# Altium project openmv-rt1062.PrjPcb
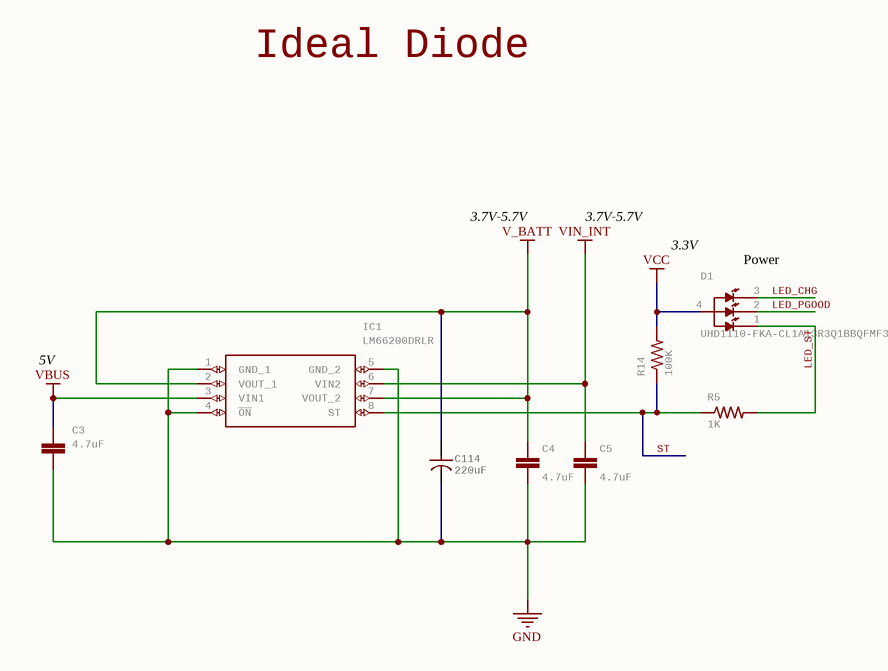
[diagram p0: ideal-diode.SchDoc]
8 sheets, 160 parts. Net scope: global (net labels, ports and power ports of the same name join across sheets).
Board file: rt10.PcbDoc
Sheets:
  ideal-diode.SchDoc
  battery-charging.SchDoc
  regulators.SchDoc
  sd-card.SchDoc
  sensor-header.SchDoc
  jtag.SchDoc
  wifi-bt.SchDoc
  mimxrt10xx.SchDoc

## Sheet ideal-diode.SchDoc
size A

### Parts
C3  4.7uF  [0402-CAP]
C4  4.7uF  [0402-CAP]
C5  4.7uF  [0402-CAP]
C114  220uF  [CAP-TANT-1411]
D1  UHD1110-FKA-CL1A13R3Q1BBQFMF3  [LED_UHD1110-FKA-CL1A13R3Q1BBQFMF3]
IC1  LM66200DRLR  [SOTFL50P160X60-8N]
R5  1K  [0402-RES]
R14  100K  [0402-RES]

### Nets
GND: C3.1 C4.1 C5.1 C114.2 IC1.1(GND_1) IC1.4(~{ON}) IC1.5(GND_2)
V_BATT: C4.2 C114.1 IC1.2(VOUT_1) IC1.7(VOUT_2)
VBUS: C3.2 IC1.3(VIN1)
VCC: D1.4(ANODE) R14.2
VIN_INT: C5.2 IC1.6(VIN2)
LED_CHG: D1.3(RED)
LED_PGOOD: D1.2(GREEN)
LED_ST: D1.1(BLUE) R5.2
ST: IC1.8(ST) R5.1 R14.1

### Notes on the sheet
- Ideal Diode
- 3.7V-5.7V
- (near D1) 3.3V
- (near D1) Power
- 5V

### Library data of the parts
C3-C5 = CAP0402-CAP: CapacitorStandard 0603 ceramic capacitor, and 0.1" leaded capacitor.; MPN: JMK105BBJ475MV-F; GateName_1: G$1; SymbolName_1: CAP; DeviceName: 0402-CAP; LibraryName: sfe; DeviceSetName: CAP; Part Number: JMK105BBJ475MV-F
C114 = CAP_POL: MANUFACTURER P/N: F930J227MBA; Part Number: F930J227MBA; DISTRIBUTOR: *; DISTRIBUTOR P/N: *; Value: 220uF; Parameter 1: *; MPN: F930J227MBA
D1 = UHD1110-FKA-CL1A13R3Q1BBQFMF3: LED RGB SMD, SIZE 1 X 1 mm Check availability; GateName_1: G$1; MF: Cree Inc.; SymbolName_1: UHD1110-FKA-CL1A13R3Q1BBQFMF3; LibraryName: UHD1110-FKA-CL1A13R3Q1BBQFMF3; DeviceSetName: UHD1110-FKA-CL1A13R3Q1BBQFMF3; AVAILABILITY: In Stock; MP: UHD1110-FKA-CL1A13R3Q1BBQFMF3; MPN: UHD1110-FKA-CL1A13r3q1BBQFMF3; PACKAGE: 0404 Cree Inc.; PRICE: None; PURCHASE-URL: https://pricing.snapeda.com/search/part/UHD1110-FKA-CL1A13R3Q1BBQFMF3/?ref=eda; Part Number: UHD1110-FKA-CL1A13r3q1BBQFMF3
IC1 = LM66200DRLR: 1.6-V to 5.5-V, 40-m, 2.5-A, low-IQ, dual ideal diode   Source:  Datasheet; MANUFACTURER_NAME: Texas Instruments; GateName_1: G$1; SymbolName_1: LM66200DRLR; LibraryName: LM66200DRLR; DeviceSetName: LM66200DRLR; HEIGHT: 0.6mm; MANUFACTURER_PART_NUMBER: LM66200DRLR; MOUSER_PART_NUMBER: 595-LM66200DRLR; MOUSER_PRICE-STOCK: https://www.mouser.co.uk/ProductDetail/Texas-Instruments/LM66200DRLR?qs=Rp5uXu7WBW90hnpZAkIOdQ%3D%3D; MPN: LM66200DRLR; Part Number: LM66200DRLR
R5 = RESISTOR0402-RES: ResistorBasic schematic elements and footprints for 0603, 1206, and PTH resistors.; MPN: CRCW04021K00FKEDC; GateName_1: G$1; SymbolName_1: RESISTOR; DeviceName: 0402-RES; LibraryName: sfe; DeviceSetName: RESISTOR; Part Number: CRCW04021K00FKEDC
R14 = RESISTOR0402-RES: ResistorBasic schematic elements and footprints for 0603, 1206, and PTH resistors.; MPN: AC0402FR-07100KL; GateName_1: G$1; SymbolName_1: RESISTOR; DeviceName: 0402-RES; LibraryName: sfe; DeviceSetName: RESISTOR; Part Number: AC0402FR-07100KL

## Sheet battery-charging.SchDoc
size A
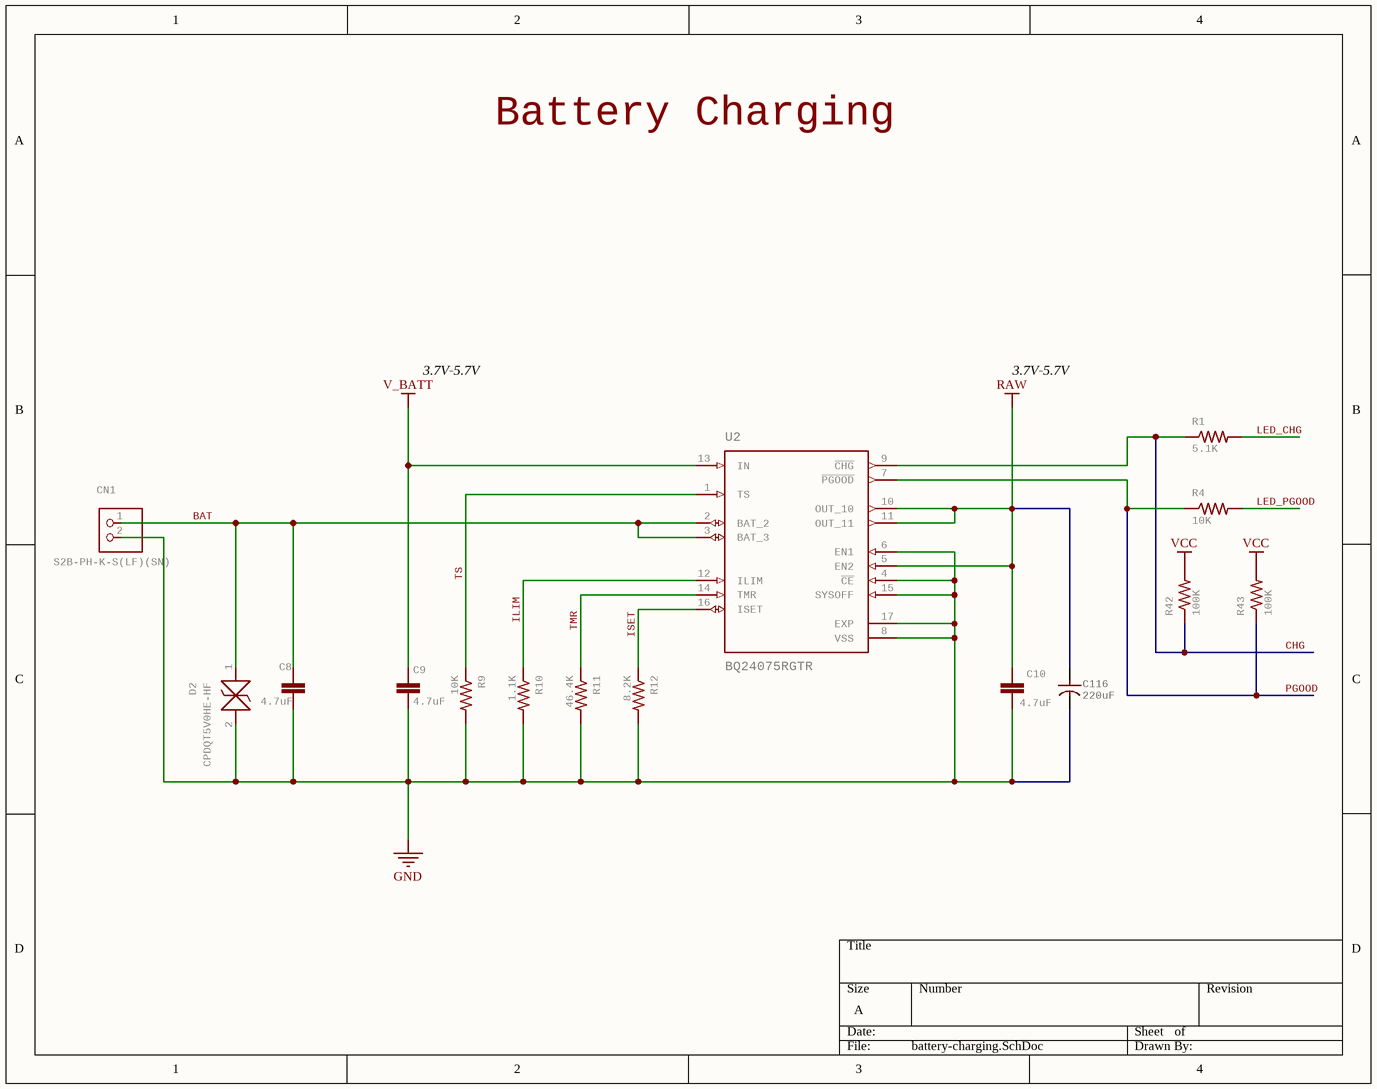
[diagram p1: battery-charging.SchDoc]

### Parts
C8  4.7uF  [0402-CAP]
C9  4.7uF  [0402-CAP]
C10  4.7uF  [0402-CAP]
C116  220uF  [CAP-TANT-1411]
CN1  S2B-PH-K-S(LF)(SN)  [JST-PH-2-THM-RA]
D2  CPDQT5V0HE-HF  [CPDQT5V0HEHF]
R1  5.1K  [0402-RES]
R4  10K  [0402-RES]
R9  10K  [0402-RES]
R10  1.1K  [0402-RES]
R11  46.4K  [0402-RES]
R12  8.2K  [0402-RES]
R42  100K  [0402-RES]
R43  100K  [0402-RES]
U2  BQ24075RGTR  [QFN50P300X300X100-17N]

### Nets
GND: C8.1 C9.1 C10.1 C116.2 CN1.2 D2.2 R9.2 R10.2 R11.2 R12.2 U2.4(~{CE}) U2.6(EN1) U2.8(VSS) U2.15(SYSOFF) U2.17(EXP)
RAW: C10.2 C116.1 U2.5(EN2) U2.10(OUT_10) U2.11(OUT_11)
V_BATT: C9.2 U2.13(IN)
VCC: R42.2 R43.2
BAT: C8.2 CN1.1 D2.1 U2.2(BAT_2) U2.3(BAT_3)
CHG: R1.1 R42.1 U2.9(~{CHG})
ILIM: R10.1 U2.12(ILIM)
ISET: R12.1 U2.16(ISET)
LED_CHG: R1.2
LED_PGOOD: R4.2
PGOOD: R4.1 R43.1 U2.7(~{PGOOD})
TMR: R11.1 U2.14(TMR)
TS: R9.1 U2.1(TS)

### Notes on the sheet
- Battery Charging
- 3.7V-5.7V

### Library data of the parts
C8-C10 = CAP0402-CAP: as C3 on sheet ideal-diode; DeviceName: 0402-CAP; LibraryName: sfe; DeviceSetName: CAP; Part Number: JMK105BBJ475MV-F
C116 = CAP_POL: MANUFACTURER P/N: F930J227MBA; Part Number: F930J227MBA; DISTRIBUTOR: *; DISTRIBUTOR P/N: *; Value: 220uF; Parameter 1: *; MPN: F930J227MBA
CN1 = JST_2PIN-THM-RA: JST 2-Pin Connectors of various flavors SMT-RA (S2B-PH-SM4) 4UConnector #17311  SMT  (B2B-PH-SM4)  THM-RA (S2B-PH)  THM  (B2B-PH); GateName_1: G$1; SymbolName_1: PINHD2; DeviceName: -THM-RA; LibraryName: adafruit-updated; DeviceSetName: JST_2PIN; MPN: S2B-PH-K-S(LF)(SN); Part Number: S2B-PH-K-S(LF)(SN)
D2 = CPDQT5V0HE-HF: ESD Suppressors / TVS Diodes DIODE ESD 5VWM 65W 0402/SOD-923F   Source:  Datasheet; MANUFACTURER_NAME: Comchip Technology; GateName_1: G$1; SymbolName_1: CPDQT5V0HE-HF; LibraryName: CPDQT5V0HE-HF; DeviceSetName: CPDQT5V0HE-HF; HEIGHT: 0.42mm; MANUFACTURER_PART_NUMBER: CPDQT5V0HE-HF; MOUSER_PART_NUMBER: MOUSER_PART_NUMBER; MOUSER_PRICE-STOCK: MOUSER_PRICE-STOCK; MPN: CPDQT5V0HE-HF; Part Number: CPDQT5V0HE-HF
R1 = RESISTOR0402-RES: ResistorBasic schematic elements and footprints for 0603, 1206, and PTH resistors.; MPN: RC0402JR-075K1L; GateName_1: G$1; SymbolName_1: RESISTOR; DeviceName: 0402-RES; LibraryName: sfe; DeviceSetName: RESISTOR; Part Number: RC0402JR-075K1L
R4 R9 = RESISTOR0402-RES: ResistorBasic schematic elements and footprints for 0603, 1206, and PTH resistors.; MPN: AC0402FR-1310KL; GateName_1: G$1; SymbolName_1: RESISTOR; DeviceName: 0402-RES; LibraryName: sfe; DeviceSetName: RESISTOR; Part Number: AC0402FR-1310KL
R10 = RESISTOR0402-RES: ResistorBasic schematic elements and footprints for 0603, 1206, and PTH resistors.; MPN: RC0402JR-071K1; GateName_1: G$1; SymbolName_1: RESISTOR; DeviceName: 0402-RES; LibraryName: sfe; DeviceSetName: RESISTOR; Part Number: RC0402JR-071K1
R11 = RESISTOR0402-RES: ResistorBasic schematic elements and footprints for 0603, 1206, and PTH resistors.; MPN: WR04X4642FTL; GateName_1: G$1; SymbolName_1: RESISTOR; DeviceName: 0402-RES; LibraryName: sfe; DeviceSetName: RESISTOR; Part Number: WR04X4642FTL
R12 = RESISTOR0402-RES: ResistorBasic schematic elements and footprints for 0603, 1206, and PTH resistors.; MPN: CR0402-FX-8201GLF; GateName_1: G$1; SymbolName_1: RESISTOR; DeviceName: 0402-RES; LibraryName: sfe; DeviceSetName: RESISTOR; Part Number: CR0402-FX-8201GLF
R42 R43 = RESISTOR0402-RES: as R14 on sheet ideal-diode; SymbolName_1: RESISTOR; DeviceName: 0402-RES; LibraryName: sfe; DeviceSetName: RESISTOR; Part Number: AC0402FR-07100KL
U2 = BQ24075RGTR: Standalone 1-cell 1.5-A linear charger, Power Path, 4.2-V VBAT and 5.5-V VOUT 16-VQFN -40 to 85  Check availability; GateName_1: G$1; MF: Texas Instruments; SymbolName_1: BQ24075RGTR; LibraryName: BQ24075RGTR; DeviceSetName: BQ24075RGTR; AVAILABILITY: In Stock; MP: BQ24075RGTR; MPN: BQ24075RGTR; PACKAGE: VQFN-16 Texas Instruments; PRICE: None; PURCHASE-URL: https://pricing.snapeda.com/search/part/BQ24075RGTR/?ref=eda; Part Number: BQ24075RGTR

## Sheet regulators.SchDoc
size A
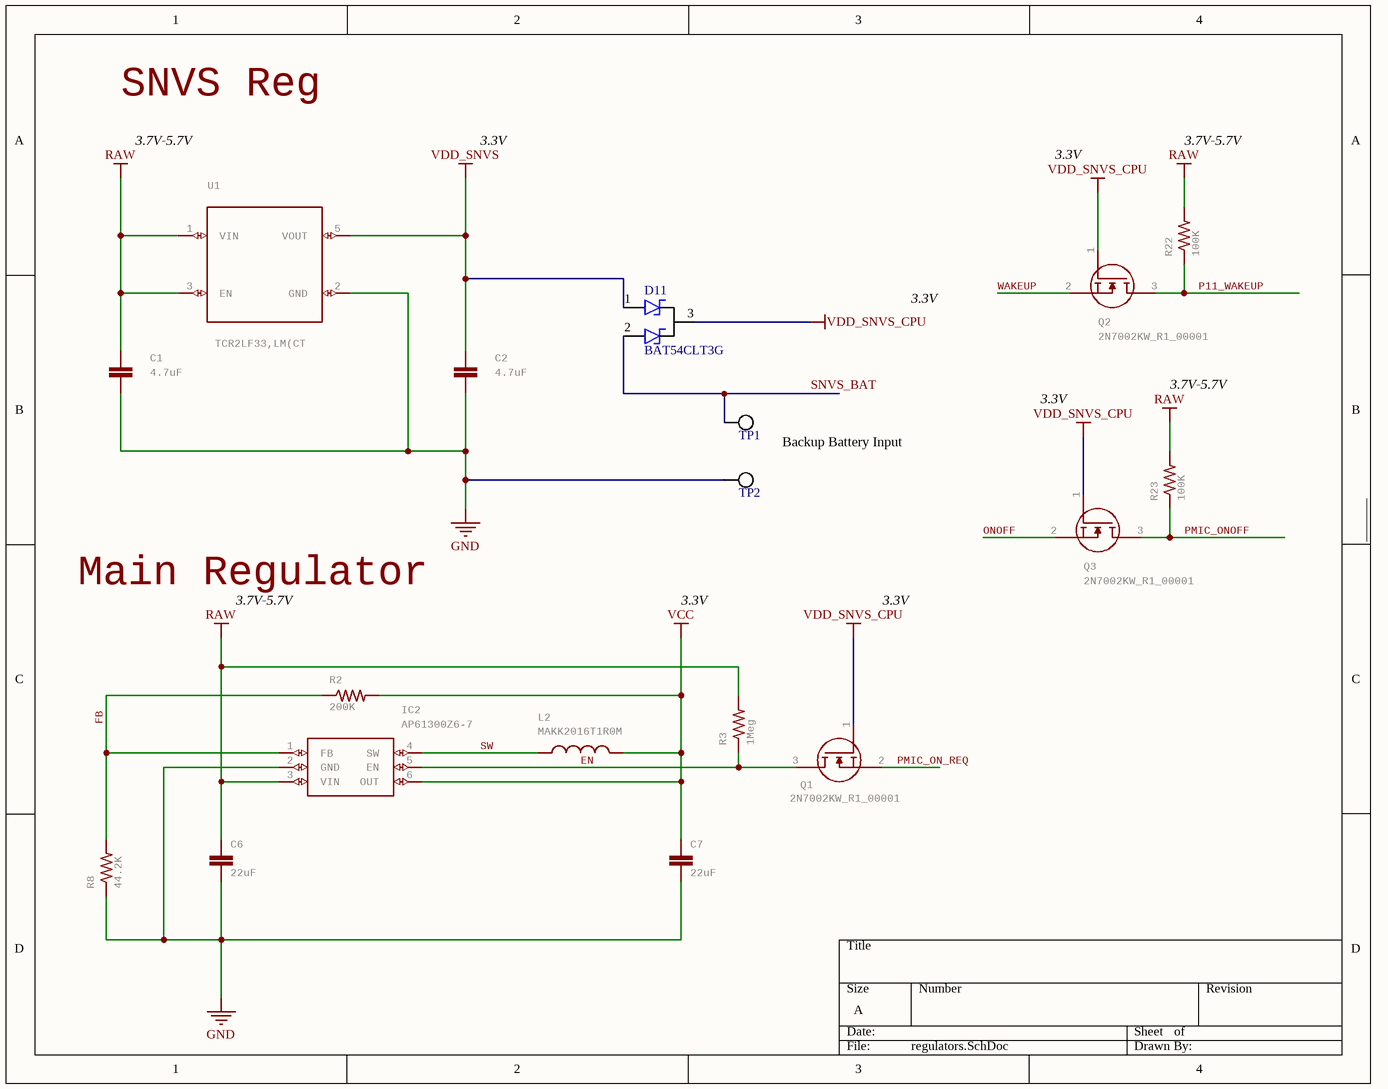
[diagram p2: regulators.SchDoc]

### Parts
C1  4.7uF  [0402-CAP]
C2  4.7uF  [0402-CAP]
C6  22uF  [0805]
C7  22uF  [0805]
D11  MPN: BAT54CLT3G  [SOT-23-3]  (hidden comment: Dual Schottky)
IC2  AP61300Z6-7  [SOTFL50P162X60-6N]
L2  MAKK2016T1R0M  [INDC2016X100N]
Q1  2N7002KW_R1_00001  [SOT65P210X110-3N]
Q2  2N7002KW_R1_00001  [SOT65P210X110-3N]
Q3  2N7002KW_R1_00001  [SOT65P210X110-3N]
R2  200K  [0402-RES]
R3  1Meg  [0402-RES]
R8  44.2K  [0402-RES]
R22  100K  [0402-RES]
R23  100K  [0402-RES]
TP1  TP  [TP_1p8]  (value not drawn)  (no BOM)
TP2  TP  [TP_1p8]  (value not drawn)  (no BOM)
U1  TCR2LF33,LM(CT  [SOT-23-5]

### Nets
GND: C1.1 C2.1 C6.2 C7.2 IC2.2(GND) R8.1 TP2.1 U1.2(GND)
RAW: C1.2 C6.1 IC2.3(VIN) R3.2 R22.2 R23.2 U1.1(VIN) U1.3(EN)
VCC: C7.1 IC2.6(OUT) L2.2 R2.2
VDD_SNVS: C2.2 D11.1 U1.5(VOUT)
VDD_SNVS_CPU: D11.3 Q1.1(G) Q2.1(G) Q3.1(G)
EN: IC2.5(EN) Q1.3(D) R3.1
FB: IC2.1(FB) R2.1 R8.2
ONOFF: Q3.2(S)
P11_WAKEUP: Q2.3(D) R22.1
PMIC_ON_REQ: Q1.2(S)
PMIC_ONOFF: Q3.3(D) R23.1
SNVS_BAT: D11.2 TP1.1
SW: IC2.4(SW) L2.1
WAKEUP: Q2.2(S)

### Notes on the sheet
- SNVS Reg
- 3.7V-5.7V
- 3.3V
- Backup Battery Input
- Main Regulator

### Library data of the parts
C1 C2 = CAP0402-CAP: as C3 on sheet ideal-diode; DeviceName: 0402-CAP; LibraryName: sfe; DeviceSetName: CAP; Part Number: JMK105BBJ475MV-F
C6 C7 = 22UF-0805-6.3V-20%: 22ÂµF ceramic capacitors    A capacitor is a passive two-terminal electrical component used to store electrical energy temporarily in an electric field.; MPN: CL21A226MQQNNNE; GateName_1: G$1; SymbolName_1: CAP; PROD_ID: CAP-08402; DeviceName: -0805-6.3V-20%; LibraryName: SparkFun-Capacitors; DeviceSetName: 22UF; Part Number: CL21A226MQQNNNE
D11 = Dual Schottky: Value: ?V; Part Number: BAT54CLT3G
IC2 = AP61300Z6-7: DCDC Conv LV Buck SOT563 T&R 3K   Source:  Datasheet; MANUFACTURER_NAME: Diodes Inc.; GateName_1: G$1; SymbolName_1: AP61300Z6-7; LibraryName: AP61300Z6-7; DeviceSetName: AP61300Z6-7; HEIGHT: 0.6mm; MANUFACTURER_PART_NUMBER: AP61300Z6-7; MOUSER_PART_NUMBER: 621-AP61300Z6-7; MOUSER_PRICE-STOCK: https://www.mouser.co.uk/ProductDetail/Diodes-Incorporated/AP61300Z6-7?qs=HBWAp0VN4Ri0dzb0XP2pEA%3D%3D; MPN: AP61300Z6-7; Part Number: AP61300Z6-7
L2 = MAKK2016T1R0M: Ind Power Wirewound 1uH 20% 2MHz Metal 2200mA 0806 Check availability; GateName_1: G$1; MF: Taiyo Yuden; SymbolName_1: MAKK2016T1R0M; LibraryName: MAKK2016T1R0M; DeviceSetName: MAKK2016T1R0M; AVAILABILITY: In Stock; MP: MAKK2016T1R0M; MPN: MAKK2016T1R0M; PACKAGE: 2016 Taiyo Yuden; PRICE: None; PURCHASE-URL: https://pricing.snapeda.com/search/part/MAKK2016T1R0M/?ref=eda; Part Number: MAKK2016T1R0M
Q1-Q3 = 2N7002KW_R1_00001: MOSFET 60V N-Channel Enhancement Mode MOSFET - ESD Protected   Source:  Datasheet; MANUFACTURER_NAME: PANJIT; GateName_1: G$1; SymbolName_1: 2N7002KW_R1_00001; LibraryName: 2N7002KW_R1_00001; DeviceSetName: 2N7002KW_R1_00001; HEIGHT: 1.1mm; MANUFACTURER_PART_NUMBER: 2N7002KW_R1_00001; MOUSER_PART_NUMBER: 241-2N7002KWR100001; MOUSER_PRICE-STOCK: https://www.mouser.co.uk/ProductDetail/Panjit/2N7002KW_R1_00001?qs=sPbYRqrBIVliWKATqv7jNA%3D%3D; MPN: 2N7002KW_R1_00001; Part Number: 2N7002KW_R1_00001
R2 = RESISTOR0402-RES: ResistorBasic schematic elements and footprints for 0603, 1206, and PTH resistors.; MPN: CRCW0402200KFKEDC; GateName_1: G$1; SymbolName_1: RESISTOR; DeviceName: 0402-RES; LibraryName: sfe; DeviceSetName: RESISTOR; Part Number: CRCW0402200KFKEDC
R3 = RESISTOR0402-RES: ResistorBasic schematic elements and footprints for 0603, 1206, and PTH resistors.; MPN: CRCW04021M00FKEDC; GateName_1: G$1; SymbolName_1: RESISTOR; DeviceName: 0402-RES; LibraryName: sfe; DeviceSetName: RESISTOR; Part Number: CRCW04021M00FKEDC
R8 = RESISTOR0402-RES: ResistorBasic schematic elements and footprints for 0603, 1206, and PTH resistors.; MPN: AC0402FR-0744K2L; GateName_1: G$1; SymbolName_1: RESISTOR; DeviceName: 0402-RES; LibraryName: sfe; DeviceSetName: RESISTOR; Part Number: AC0402FR-0744K2L
R22 R23 = RESISTOR0402-RES: as R14 on sheet ideal-diode; SymbolName_1: RESISTOR; DeviceName: 0402-RES; LibraryName: sfe; DeviceSetName: RESISTOR; Part Number: AC0402FR-07100KL
U1 = TCR2LF33,LM(CT: GateName_1: G$1; SymbolName_1: TCR2LF33,LM(CT; LibraryName: TCR2LF33,LM(CT; DeviceSetName: TCR2LF33,LM(CT; MPN: TCR2LF33,LM(CT

## Sheet sd-card.SchDoc
size A
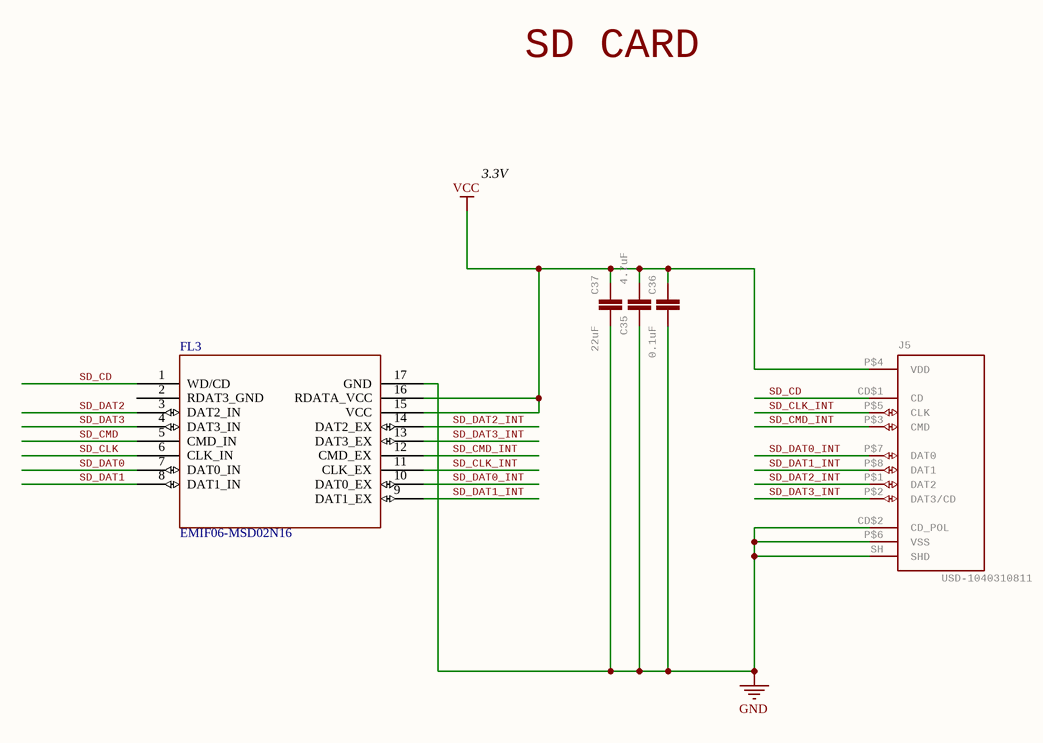
[diagram p3: sd-card.SchDoc]

### Parts
C35  4.7uF  [0402-CAP]
C36  0.1uF  [0402-CAP]
C37  22uF  [0805]
FL3  EMIF06-MSD02N16  [MICROQFN16_1p25x3p55x0p4_STM]
J5  USD-1040310811  [1040310811]

### Nets
GND: C35.1 C36.2 C37.2 FL3.17(GND) J5.CD$2(CD_POL) J5.P$6(VSS) J5.SH(SHD)
VCC: C35.2 C36.1 C37.1 FL3.15(VCC) FL3.16(RDATA_VCC) J5.P$4(VDD)
SD_CD: FL3.1(WD/CD) J5.CD$1(CD)
SD_CLK: FL3.6(CLK_IN)
SD_CLK_INT: FL3.11(CLK_EX) J5.P$5(CLK)
SD_CMD: FL3.5(CMD_IN)
SD_CMD_INT: FL3.12(CMD_EX) J5.P$3(CMD)
SD_DAT0: FL3.7(DAT0_IN)
SD_DAT0_INT: FL3.10(DAT0_EX) J5.P$7(DAT0)
SD_DAT1: FL3.8(DAT1_IN)
SD_DAT1_INT: FL3.9(DAT1_EX) J5.P$8(DAT1)
SD_DAT2: FL3.3(DAT2_IN)
SD_DAT2_INT: FL3.14(DAT2_EX) J5.P$1(DAT2)
SD_DAT3: FL3.4(DAT3_IN)
SD_DAT3_INT: FL3.13(DAT3_EX) J5.P$2(DAT3/CD)

Not connected (* = marked no-connect by the designer): FL3 2(RDAT3_GND)

### Notes on the sheet
- SD CARD
- 3.3V

### Library data of the parts
C35 = CAP0402-CAP: as C3 on sheet ideal-diode; DeviceName: 0402-CAP; LibraryName: sfe; DeviceSetName: CAP; Part Number: JMK105BBJ475MV-F
C36 = C-EUC0201: CAPACITOR, European symbol; MPN: C0402C104Z4VAC; GateName_1: G$1; SymbolName_1: C-EU; POPULARITY: 0; LibraryName: rcl; DeviceSetName: C-EU; SPICEPREFIX: C; Part Number: C0402C104Z4VAC
C37 = 22UF-0805-6.3V-20%: as C6 on sheet regulators; DeviceName: -0805-6.3V-20%; LibraryName: SparkFun-Capacitors; DeviceSetName: 22UF; Part Number: CL21A226MQQNNNE
FL3 = EMIF06-MSD02N16: No Description Available; MPN: EMIF06-MSD02N16; Part Numbre: EMIF06-MSD02N16
J5 = USD-1040310811: uSD Slot; MPN: 104031-0811; GateName_1: G$1; SymbolName_1: USD; LibraryName: 1040310811; DeviceSetName: USD-1040310811; Part Number: 104031-0811

## Sheet sensor-header.SchDoc
size A
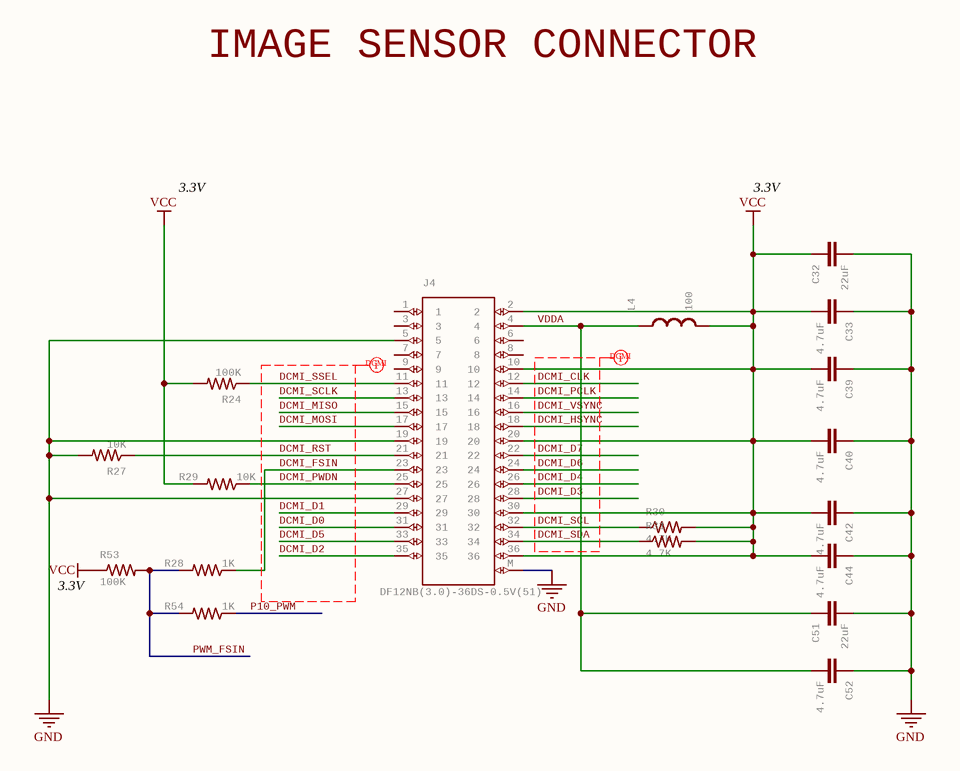
[diagram p4: sensor-header.SchDoc]

### Parts
C32  22uF  [0805]
C33  4.7uF  [0402-CAP]
C39  4.7uF  [0402-CAP]
C40  4.7uF  [0402-CAP]
C42  4.7uF  [0402-CAP]
C44  4.7uF  [0402-CAP]
C51  22uF  [0805]
C52  4.7uF  [0402-CAP]
J4  DF12NB(3.0)-36DS-0.5V(51)  [DF12-36-DS]
L4  100  [C0402]
R24  100K  [0402-RES]
R27  10K  [0402-RES]
R28  1K  [0402-RES]
R29  10K  [0402-RES]
R30  4.7K  [0402-RES]
R31  4.7K  [0402-RES]
R53  100K  [0402-RES]
R54  1K  [0402-RES]

### Nets
GND: C32.2 C33.1 C39.1 C40.1 C42.1 C44.1 C51.2 C52.1 J4.5 J4.19 J4.27 J4.M R27.2
VCC: C32.1 C33.2 C39.2 C40.2 C42.2 C44.2 J4.2 J4.10 J4.20 J4.30 J4.36 L4.2 R24.2 R29.2 R30.2 R31.2 R53.1
DCMI_CLK: J4.12
DCMI_D0: J4.31
DCMI_D1: J4.29
DCMI_D2: J4.35
DCMI_D3: J4.28
DCMI_D4: J4.26
DCMI_D5: J4.33
DCMI_D6: J4.24
DCMI_D7: J4.22
DCMI_FSIN: J4.23 R28.1
DCMI_HSYNC: J4.18
DCMI_MISO: J4.15
DCMI_MOSI: J4.17
DCMI_PCLK: J4.14
DCMI_PWDN: J4.25 R29.1
DCMI_RST: J4.21 R27.1
DCMI_SCL: J4.32 R30.1
DCMI_SCLK: J4.13
DCMI_SDA: J4.34 R31.1
DCMI_SSEL: J4.11 R24.1
DCMI_VSYNC: J4.16
P10_PWM: R54.1
PWM_FSIN: R28.2 R53.2 R54.2
VDDA: C51.1 C52.2 J4.4 L4.1

Not connected (* = marked no-connect by the designer): J4 1 3 6 7 8 9

### Layout directives
net class DCMI: DCMI_CLK, DCMI_D0, DCMI_D1, DCMI_D2, DCMI_D3, DCMI_D4, DCMI_D5, DCMI_D6, DCMI_D7, DCMI_FSIN, DCMI_HSYNC, DCMI_MISO, DCMI_MOSI, DCMI_PCLK, DCMI_PWDN, DCMI_RST, DCMI_SCL, DCMI_SCLK, DCMI_SDA, DCMI_SSEL, DCMI_VSYNC

### Notes on the sheet
- IMAGE SENSOR CONNECTOR
- 3.3V
- (near R53) 3.3V

### Library data of the parts
C32 C51 = 22UF-0805-6.3V-20%: as C6 on sheet regulators; DeviceName: -0805-6.3V-20%; LibraryName: SparkFun-Capacitors; DeviceSetName: 22UF; Part Number: CL21A226MQQNNNE
C33 C39 C40 C42 C44 C52 = CAP0402-CAP: as C3 on sheet ideal-diode; DeviceName: 0402-CAP; LibraryName: sfe; DeviceSetName: CAP; Part Number: JMK105BBJ475MV-F
J4 = DF12-36-DS: Header; GateName_1: G$1; SymbolName_1: DF12-36; LibraryName: DF12-36-DS; DeviceSetName: DF12-36-DS; MPN: DF12NB(3.0)-36DS-0.5V(51); Part Number: DF12NB(3.0)-36DS-0.5V(51)
L4 = INDUCTOR0402: InductorsBasic Inductor/Choke - 0603 and 1206. Footprints are not proven and vary greatly between part numbers.; MPN: MFBM1V1005-101-R; GateName_1: G$1; DeviceName: 0402; SymbolName_1: INDUCTOR; LibraryName: sfe; DeviceSetName: INDUCTOR; Part Number: MFBM1V1005-101-R
R24 R53 = RESISTOR0402-RES: as R14 on sheet ideal-diode; SymbolName_1: RESISTOR; DeviceName: 0402-RES; LibraryName: sfe; DeviceSetName: RESISTOR; Part Number: AC0402FR-07100KL
R27 R29 = RESISTOR0402-RES: ResistorBasic schematic elements and footprints for 0603, 1206, and PTH resistors.; MPN: AC0402FR-1310K; GateName_1: G$1; SymbolName_1: RESISTOR; DeviceName: 0402-RES; LibraryName: sfe; DeviceSetName: RESISTOR; Part Number: AC0402FR-1310K
R28 R54 = RESISTOR0402-RES: as R5 on sheet ideal-diode; SymbolName_1: RESISTOR; DeviceName: 0402-RES; LibraryName: sfe; DeviceSetName: RESISTOR; Part Number: CRCW04021K00FKEDC
R30 R31 = RESISTOR0402-RES: ResistorBasic schematic elements and footprints for 0603, 1206, and PTH resistors.; MPN: AC0402FR-074K7L; GateName_1: G$1; SymbolName_1: RESISTOR; DeviceName: 0402-RES; LibraryName: sfe; DeviceSetName: RESISTOR; Part Number: AC0402FR-074K7L

## Sheet jtag.SchDoc
size A
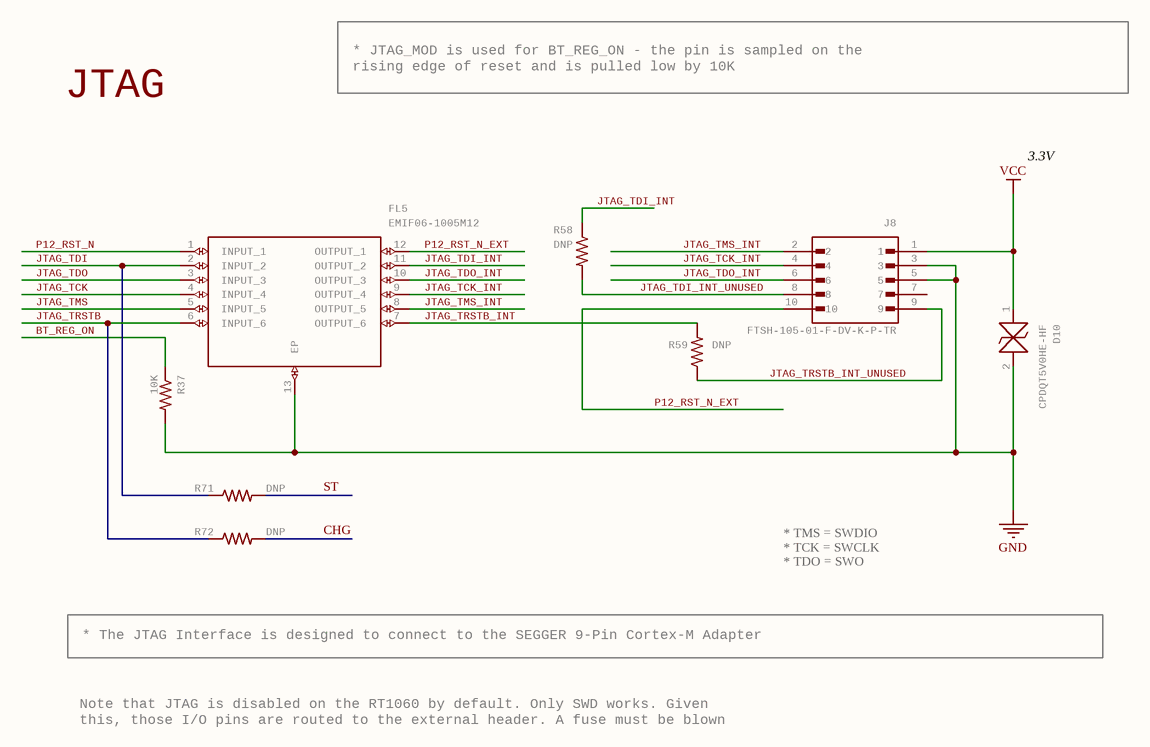
[diagram p5: jtag.SchDoc]

### Parts
D10  CPDQT5V0HE-HF  [CPDQT5V0HEHF]
FL5  EMIF06-1005M12  [SON40P150X250X65-13N]
J8  FTSH-105-01-F-DV-K-P-TR  [CNC_3221-10-0300-00]
R37  10K  [0402-RES]
R58  DNP  [0402-RES]
R59  DNP  [0402-RES]
R71  DNP  [0402-RES]
R72  DNP  [0402-RES]

### Nets
GND: D10.2 FL5.13(EP) J8.3 J8.5 R37.2
VCC: D10.1 J8.1
BT_REG_ON: R37.1
CHG: R72.2
JTAG_TCK: FL5.4(INPUT_4)
JTAG_TCK_INT: FL5.9(OUTPUT_4) J8.4
JTAG_TDI: FL5.2(INPUT_2) R71.1
JTAG_TDI_INT: FL5.11(OUTPUT_2) R58.1
JTAG_TDI_INT_UNUSED: J8.8 R58.2
JTAG_TDO: FL5.3(INPUT_3)
JTAG_TDO_INT: FL5.10(OUTPUT_3) J8.6
JTAG_TMS: FL5.5(INPUT_5)
JTAG_TMS_INT: FL5.8(OUTPUT_5) J8.2
JTAG_TRSTB: FL5.6(INPUT_6) R72.1
JTAG_TRSTB_INT: FL5.7(OUTPUT_6) R59.2
JTAG_TRSTB_INT_UNUSED: J8.9 R59.1
P12_RST_N: FL5.1(INPUT_1)
P12_RST_N_EXT: FL5.12(OUTPUT_1) J8.10
ST: R71.2

Not connected (* = marked no-connect by the designer): J8 7

### Notes on the sheet
- * JTAG_MOD is used for BT_REG_ON - the pin is sampled on the
  rising edge of reset and is pulled low by 10K
- JTAG
- 3.3V
- * The JTAG Interface is designed to connect to the SEGGER 9-Pin Cortex-M Adapter
- * TMS = SWDIO
  * TCK = SWCLK
  * TDO = SWO
- Note that JTAG is disabled on the RT1060 by default. Only SWD works. Given this, those I/O pins are routed to the external header. A fuse must be blown to switch to JTAG which disables SWD

### Library data of the parts
D10 = CPDQT5V0HE-HF: as D2 on sheet battery-charging; SymbolName_1: CPDQT5V0HE-HF; LibraryName: CPDQT5V0HE-HF; DeviceSetName: CPDQT5V0HE-HF; HEIGHT: 0.42mm; MANUFACTURER_PART_NUMBER: CPDQT5V0HE-HF; MOUSER_PART_NUMBER: MOUSER_PART_NUMBER; MOUSER_PRICE-STOCK: MOUSER_PRICE-STOCK; MPN: CPDQT5V0HE-HF; Part Number: CPDQT5V0HE-HF
FL5 = EMIF06-1005M12: EMI Filter Circuits 6lin lw cpcitnc EMI 45pF -35db @ 900MHz   Source:  Datasheet; MANUFACTURER_NAME: STMicroelectronics; GateName_1: G$1; SymbolName_1: EMIF06-1005M12; LibraryName: EMIF06-1005M12; DeviceSetName: EMIF06-1005M12; HEIGHT: 0.65mm; MANUFACTURER_PART_NUMBER: EMIF06-1005M12; MOUSER_PART_NUMBER: 511-EMIF06-1005M12; MOUSER_PRICE-STOCK: https://www.mouser.co.uk/ProductDetail/STMicroelectronics/EMIF06-1005M12?qs=VJaATVMq%252BXo0u09ZqtQg3A%3D%3D; MPN: EMIF06-1005M12; Part Number: EMIF06-1005M12
J8 = 3221-10-0300-00: Check availability; GateName_1: G$1; MF: CNC Tech; SymbolName_1: 3221-10-0300-00; LibraryName: 3221-10-0300-00; DeviceSetName: 3221-10-0300-00; AVAILABILITY: In Stock; MP: FTSH-105-01-F-DV-K-P-TR; MPN: FTSH-105-01-F-DV-K-P-TR; PACKAGE: None; PRICE: None; PURCHASE-URL: https://pricing.snapeda.com/search/part/3221-10-0300-00/?ref=eda; Part Number: FTSH-105-01-F-DV-K-P-TR
R37 = RESISTOR0402-RES: as R4 on sheet battery-charging; SymbolName_1: RESISTOR; DeviceName: 0402-RES; LibraryName: sfe; DeviceSetName: RESISTOR; Part Number: AC0402FR-1310KL
R58 R59 R71 R72 = RESISTOR0402-RES: ResistorBasic schematic elements and footprints for 0603, 1206, and PTH resistors.; GateName_1: G$1; SymbolName_1: RESISTOR; DeviceName: 0402-RES; LibraryName: sfe; DeviceSetName: RESISTOR; MPN: DNP; Part Number: DNP

## Sheet wifi-bt.SchDoc
size A
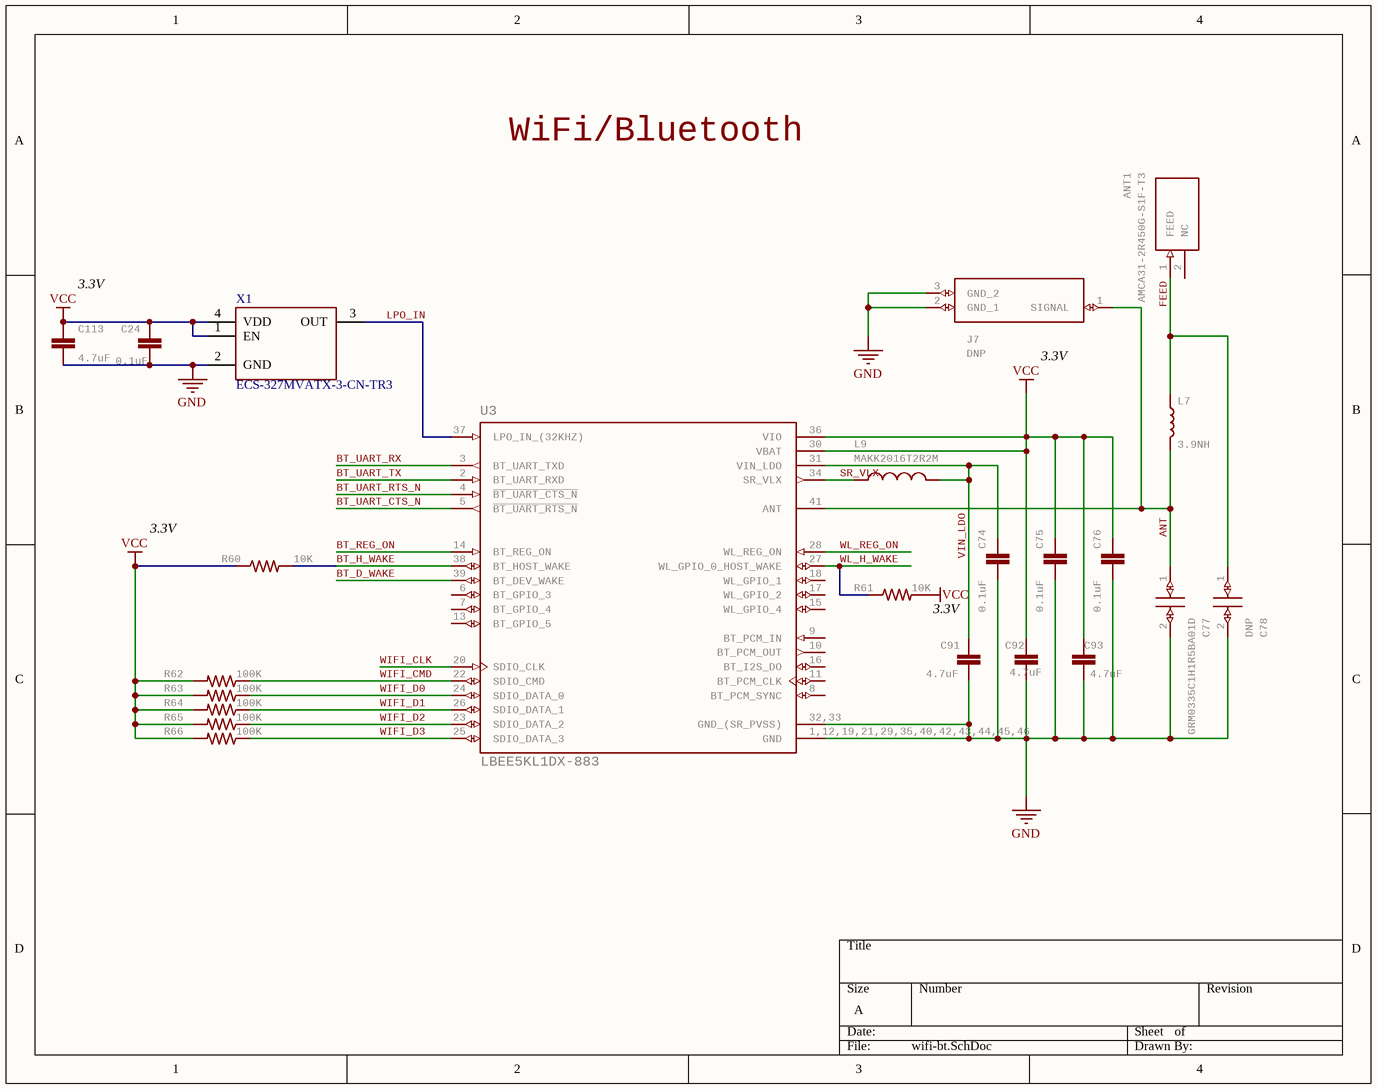
[diagram p6: wifi-bt.SchDoc]

### Parts
ANT1  AMCA31-2R450G-S1F-T3  [ANTC3216X140N]
C24  0.1uF  [0402-CAP]
C74  0.1uF  [0402-CAP]
C75  0.1uF  [0402-CAP]
C76  0.1uF  [0402-CAP]
C77  GRM0335C1H1R5BA01D  [CAPC0603X33N]
C78  DNP  [C0201-NO-3D]
C91  4.7uF  [0402-CAP]
C92  4.7uF  [0402-CAP]
C93  4.7uF  [0402-CAP]
C113  4.7uF  [0402-CAP]
J7  DNP  [23370191-NO-3D]
L7  3.9NH  [0402]
L9  MAKK2016T2R2M  [INDC2016X100N]
R60  10K  [0402-RES]
R61  10K  [0402-RES]
R62  100K  [0402-RES]
R63  100K  [0402-RES]
R64  100K  [0402-RES]
R65  100K  [0402-RES]
R66  100K  [0402-RES]
U3  LBEE5KL1DX-883  [XCVR_LBEE5KL1DX-TEMP]
X1  ECS-327MVATX-3-CN-TR3  [XTAL_3225]

### Nets
GND: C24.2 C74.2 C75.2 C76.2 C77.2 C78.2 C91.1 C92.1 C93.1 C113.1 J7.2(GND_1) J7.3(GND_2) U3.1,12,19,21,29,35,40,42,43,44,45,46(GND) U3.32,33(GND_(SR_PVSS)) X1.2(GND)
VCC: C24.1 C75.1 C76.1 C92.2 C93.2 C113.2 R60.1 R61.2 R62.2 R63.2 R64.2 R65.2 R66.2 U3.30(VBAT) U3.36(VIO) X1.1(EN) X1.4(VDD)
ANT: C77.1 J7.1(SIGNAL) L7.2 U3.41(ANT)
BT_D_WAKE: U3.39(BT_DEV_WAKE)
BT_H_WAKE: R60.2 U3.38(BT_HOST_WAKE)
BT_REG_ON: U3.14(BT_REG_ON)
BT_UART_CTS_N: U3.5(~{BT_UART_RTS_N})
BT_UART_RTS_N: U3.4(~{BT_UART_CTS_N})
BT_UART_RX: U3.3(BT_UART_TXD)
BT_UART_TX: U3.2(BT_UART_RXD)
FEED: ANT1.1(FEED) C78.1 L7.1
LPO_IN: U3.37(LPO_IN_(32KHZ)) X1.3(OUT)
SR_VLX: L9.1 U3.34(SR_VLX)
VIN_LDO: C74.1 C91.2 L9.2 U3.31(VIN_LDO)
WIFI_CLK: U3.20(SDIO_CLK)
WIFI_CMD: R62.1 U3.22(SDIO_CMD)
WIFI_D0: R63.1 U3.24(SDIO_DATA_0)
WIFI_D1: R64.1 U3.26(SDIO_DATA_1)
WIFI_D2: R65.1 U3.23(SDIO_DATA_2)
WIFI_D3: R66.1 U3.25(SDIO_DATA_3)
WL_H_WAKE: R61.1 U3.27(WL_GPIO_0_HOST_WAKE)
WL_REG_ON: U3.28(WL_REG_ON)

Not connected (* = marked no-connect by the designer): ANT1 2(NC); U3 6(BT_GPIO_3) 7(BT_GPIO_4) 8(BT_PCM_SYNC) 9(BT_PCM_IN) 10(BT_PCM_OUT) 11(BT_PCM_CLK) 13(BT_GPIO_5) 15(WL_GPIO_4) 16(BT_I2S_DO) 17(WL_GPIO_2) 18(WL_GPIO_1)

### Notes on the sheet
- WiFi/Bluetooth
- 3.3V
- (near J7) 3.3V

### Library data of the parts
ANT1 = AMCA31-2R450G-S1F-T3: ABRACON - AMCA31-2R450G-S1F-T3 - ANTENNA, CHIP, 2.45GHZ, 50 OHM, 1206   Source:  Datasheet; GateName_1: G$1; SymbolName_1: AMCA31-2R450G-S1F-T3; LibraryName: AMCA31-2R450G-S1F-T3; DeviceSetName: AMCA31-2R450G-S1F-T3; HEIGHT: 1.4mm; MANUFACTURER_NAME: ABRACON; MANUFACTURER_PART_NUMBER: AMCA31-2R450G-S1F-T3; MOUSER_PART_NUMBER: 815-CA312R450GS1FT3; MOUSER_PRICE-STOCK: https://www.mouser.co.uk/ProductDetail/ABRACON/AMCA31-2R450G-S1F-T3?qs=AAveGqk956GLuOddQEK40Q%3D%3D; MPN: AMCA31-2R450G-S1F-T3; Part Number: AMCA31-2R450G-S1F-T3
C24 C74-C76 = C-EUC0201: as C36 on sheet sd-card; LibraryName: rcl; DeviceSetName: C-EU; SPICEPREFIX: C; Part Number: C0402C104Z4VAC
C77 = GRM0335C1H1R5BA01D: Chip Capacitor value 1R5   Source:  Datasheet; MANUFACTURER_NAME: Murata Electronics; GateName_1: G$1; SymbolName_1: GRM0335C1H1R5BA01D; LibraryName: GRM0335C1H1R5BA01D; DeviceSetName: GRM0335C1H1R5BA01D; HEIGHT: 0.33mm; MANUFACTURER_PART_NUMBER: GRM0335C1H1R5BA01D; MOUSER_PART_NUMBER: 81-GRM0335C1H1R5BA1D; MOUSER_PRICE-STOCK: https://www.mouser.co.uk/ProductDetail/Murata-Electronics/GRM0335C1H1R5BA01D?qs=7vGxPDjevFPFqveGwv%252BPUQ%3D%3D; MPN: GRM0335C1H1R5BA01D; Part Number: GRM0335C1H1R5BA01D
C78 = GRM0335C1H1R5BA01D: Chip Capacitor value 1R5   Source:  Datasheet; MANUFACTURER_NAME: Murata Electronics; GateName_1: G$1; POPULATE: 0; SymbolName_1: GRM0335C1H1R5BA01D; LibraryName: GRM0335C1H1R5BA01D; DeviceSetName: GRM0335C1H1R5BA01D; HEIGHT: 0.33mm; MANUFACTURER_PART_NUMBER: GRM0335C1H1R5BA01D; MOUSER_PART_NUMBER: 81-GRM0335C1H1R5BA1D; MOUSER_PRICE-STOCK: https://www.mouser.co.uk/ProductDetail/Murata-Electronics/GRM0335C1H1R5BA01D?qs=7vGxPDjevFPFqveGwv%252BPUQ%3D%3D; MPN: DNP; Part Number: DNP
C91-C93 C113 = CAP0402-CAP: as C3 on sheet ideal-diode; DeviceName: 0402-CAP; LibraryName: sfe; DeviceSetName: CAP; Part Number: JMK105BBJ475MV-F
J7 = 2337019-1: RF Connectors / Coaxial Connectors MicroCoax receptacle UMCC Gen 1   Source:  Datasheet; MANUFACTURER_NAME: TE Connectivity; GateName_1: G$1; POPULATE: 0; SymbolName_1: 2337019-1; LibraryName: 2337019-1; DeviceSetName: 2337019-1; HEIGHT: 1.4mm; MANUFACTURER_PART_NUMBER: 2337019-1; MOUSER_PART_NUMBER: 571-2337019-1; MOUSER_PRICE-STOCK: https://www.mouser.co.uk/ProductDetail/TE-Connectivity/2337019-1?qs=l4Gc20tDgJIuN7nS9rJkJw%3D%3D; MPN: DNP; Part Number: DNP
L7 = INDUCTOR-0402-3.9NH: Inductors    Resist changes in electrical current. Basically a coil of wire.   SparkFun Products:  SparkFun Load Cell Amplifier - HX711  IOIO-OTG - V2.2; MPN: L-07C3N9SV6T; GateName_1: G$1; PROD_ID: NDUC-13457; SymbolName_1: INDUCTOR; DeviceName: -0402-3.9NH; LibraryName: SparkFun-Coils; DeviceSetName: INDUCTOR; Part Number: L-07C3N9SV6T
L9 = MAKK2016T2R2M: INDUCTOR, METAL CORE Check availability; GateName_1: G$1; MF: Taiyo Yuden; SymbolName_1: MAKK2016T2R2M; LibraryName: MAKK2016T2R2M; DeviceSetName: MAKK2016T2R2M; AVAILABILITY: In Stock; MP: MAKK2016T2R2M; MPN: MAKK2016T2R2M; PACKAGE: 2016 Taiyo Yuden; PRICE: None; PURCHASE-URL: https://pricing.snapeda.com/search/part/MAKK2016T2R2M/?ref=eda; Part Number: MAKK2016T2R2M
R60 R61 = RESISTOR0402-RES: as R27 on sheet sensor-header; SymbolName_1: RESISTOR; DeviceName: 0402-RES; LibraryName: sfe; DeviceSetName: RESISTOR; Part Number: AC0402FR-1310K
R62-R66 = RESISTOR0402-RES: as R14 on sheet ideal-diode; SymbolName_1: RESISTOR; DeviceName: 0402-RES; LibraryName: sfe; DeviceSetName: RESISTOR; Part Number: AC0402FR-07100KL
U3 = LBEE5KL1DX-TEMP: Broadcom Chipset for 802.11b/g/n + Bluetooth 4.1/EDR; GateName_1: G$1; MF: Murata Electronics; SymbolName_1: LBEE5KL1DX-TEMP; LibraryName: LBEE5KL1DX-TEMP; DeviceSetName: LBEE5KL1DX-TEMP; AVAILABILITY: Unavailable; MP: LBEE5KL1DX-TEMP; MPN: LBEE5KL1DX-883; PACKAGE: None; PRICE: None; Part Number: LBEE5KL1DX-883
X1 = ECS-327MVATX-3-CN-TR3: Part Number: ECS-327MVATX-3-CN-TR3; MPN: ECS-327MVATX-3-CN-TR3

## Sheet mimxrt10xx.SchDoc
size C
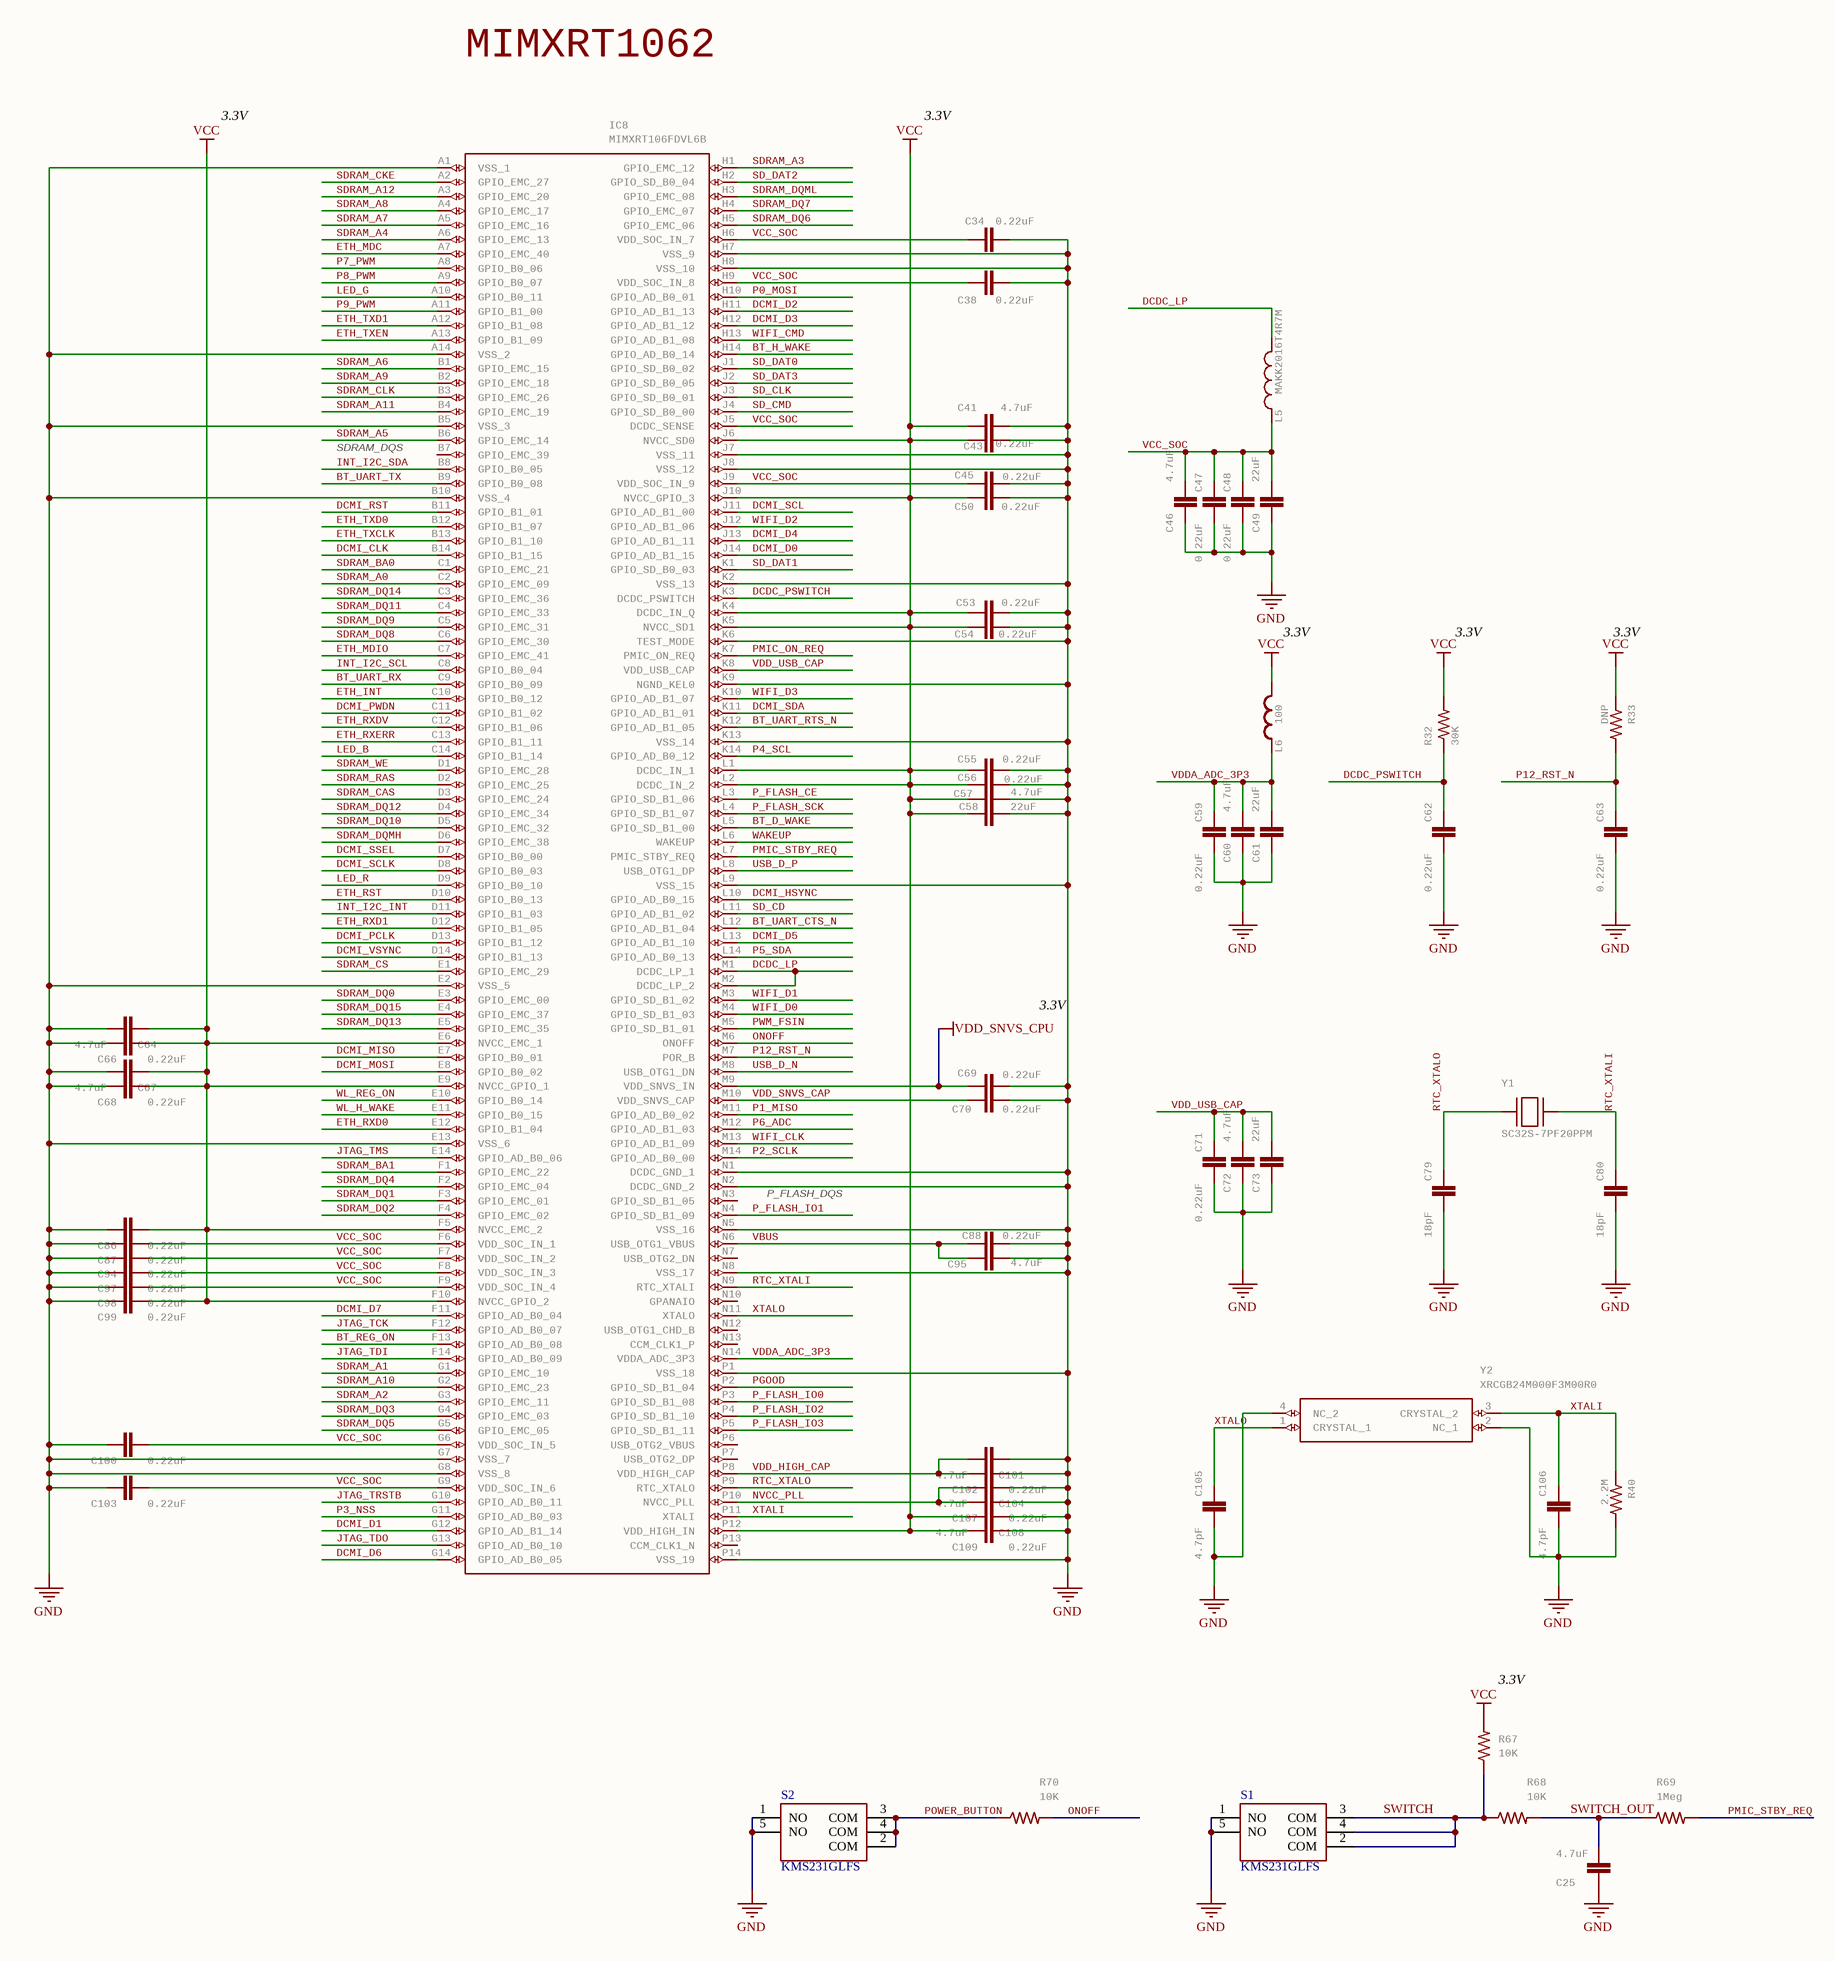
[diagram p7: mimxrt10xx.SchDoc]

### Parts
C25  4.7uF  [0402-CAP]
C34  0.22uF  [C0201]
C38  0.22uF  [C0201]
C41  4.7uF  [0402-CAP]
C43  0.22uF  [C0201]
C45  0.22uF  [C0201]
C46  4.7uF  [0402-CAP]
C47  0.22uF  [C0201]
C48  0.22uF  [C0201]
C49  22uF  [0805]
C50  0.22uF  [C0201]
C53  0.22uF  [C0201]
C54  0.22uF  [C0201]
C55  0.22uF  [C0201]
C56  0.22uF  [C0201]
C57  4.7uF  [0402-CAP]
C58  22uF  [0805]
C59  0.22uF  [C0201]
C60  4.7uF  [0402-CAP]
C61  22uF  [0805]
C62  0.22uF  [C0201]
C63  0.22uF  [C0201]
C64  4.7uF  [0402-CAP]
C66  0.22uF  [C0201]
C67  4.7uF  [0402-CAP]
C68  0.22uF  [C0201]
C69  0.22uF  [C0201]
C70  0.22uF  [C0201]
C71  0.22uF  [C0201]
C72  4.7uF  [0402-CAP]
C73  22uF  [0805]
C79  18pF  [C0201]
C80  18pF  [C0201]
C86  0.22uF  [C0201]
C87  0.22uF  [C0201]
C88  0.22uF  [C0201]
C94  0.22uF  [C0201]
C95  4.7uF  [0402-CAP]
C97  0.22uF  [C0201]
C98  0.22uF  [C0201]
C99  0.22uF  [C0201]
C100  0.22uF  [C0201]
C101  4.7uF  [0402-CAP]
C102  0.22uF  [C0201]
C103  0.22uF  [C0201]
C104  4.7uF  [0402-CAP]
C105  4.7pF  [C0201]
C106  4.7pF  [C0201]
C107  0.22uF  [C0201]
C108  4.7uF  [0402-CAP]
C109  0.22uF  [C0201]
IC8  MIMXRT106FDVL6B  [BGA196C65P14X14_1000X1000X143]
L5  MAKK2016T4R7M  [INDC2016X100N]
L6  100  [C0402]
R32  30K  [0201-RES]
R33  DNP  [0402-RES]
R40  2.2M  [0402-RES]
R67  10K  [0402-RES]
R68  10K  [0402-RES]
R69  1Meg  [0402-RES]
R70  10K  [0402-RES]
S1  KMS231GLFS  [KMS231GLFS]
S2  KMS231GLFS  [KMS231GLFS]
Y1  SC32S-7PF20PPM  [XTAL_ABS07-32.768KHZ-7-T]
Y2  XRCGB24M000F3M00R0  [XRCGB24M000F3M00R0]

### Nets
GND: C25.1 C34.2 C38.2 C41.1 C43.2 C45.2 C46.1 C47.2 C48.2 C49.1 C50.2 C53.2 C54.2 C55.2 C56.2 C57.1 C58.1 C59.2 C60.1 C61.1 C62.2 C63.2 C64.2 C66.1 C67.2 C68.1 C69.2 C70.2 C71.2 C72.1 C73.1 C79.2 C80.2 C86.1 C87.1 C88.2 C94.1 C95.1 C97.1 C98.1 C99.1 C100.1 C101.1 C102.2 C103.1 C104.1 C105.2 C106.2 C107.2 C108.1 C109.2 IC8.A1(VSS_1) IC8.A14(VSS_2) IC8.B5(VSS_3) IC8.B10(VSS_4) IC8.E2(VSS_5) IC8.E13(VSS_6) IC8.G7(VSS_7) IC8.G8(VSS_8) IC8.H7(VSS_9) IC8.H8(VSS_10) IC8.J7(VSS_11) IC8.J8(VSS_12) IC8.K2(VSS_13) IC8.K6(TEST_MODE) IC8.K9(NGND_KEL0) IC8.K13(VSS_14) IC8.L9(VSS_15) IC8.N1(DCDC_GND_1) IC8.N2(DCDC_GND_2) IC8.N5(VSS_16) IC8.N8(VSS_17) IC8.P1(VSS_18) IC8.P14(VSS_19) R40.2 S1.1(NO) S1.5(NO) S2.1(NO) S2.5(NO) Y2.2(NC_1) Y2.4(NC_2)
VBUS: C88.1 C95.2 IC8.N6(USB_OTG1_VBUS)
VCC: C41.2 C43.1 C50.1 C53.1 C54.1 C55.1 C56.1 C57.2 C58.2 C64.1 C66.2 C67.1 C68.2 C86.2 C99.2 C108.2 C109.1 IC8.E6(NVCC_EMC_1) IC8.E9(NVCC_GPIO_1) IC8.F5(NVCC_EMC_2) IC8.F10(NVCC_GPIO_2) IC8.J6(NVCC_SD0) IC8.J10(NVCC_GPIO_3) IC8.K4(DCDC_IN_Q) IC8.K5(NVCC_SD1) IC8.L1(DCDC_IN_1) IC8.L2(DCDC_IN_2) IC8.P12(VDD_HIGH_IN) L6.2 R32.2 R33.1 R67.2
VDD_SNVS_CPU: C69.1 IC8.M9(VDD_SNVS_IN)
BT_D_WAKE: IC8.L5(GPIO_SD_B1_00)
BT_H_WAKE: IC8.H14(GPIO_AD_B0_14)
BT_REG_ON: IC8.F13(GPIO_AD_B0_08)
BT_UART_CTS_N: IC8.L12(GPIO_AD_B1_04)
BT_UART_RTS_N: IC8.K12(GPIO_AD_B1_05)
BT_UART_RX: IC8.C9(GPIO_B0_09)
BT_UART_TX: IC8.B9(GPIO_B0_08)
DCDC_LP: IC8.M1(DCDC_LP_1) IC8.M2(DCDC_LP_2) L5.2
DCDC_PSWITCH: C62.1 IC8.K3(DCDC_PSWITCH) R32.1
DCMI_CLK: IC8.B14(GPIO_B1_15)
DCMI_D0: IC8.J14(GPIO_AD_B1_15)
DCMI_D1: IC8.G12(GPIO_AD_B1_14)
DCMI_D2: IC8.H11(GPIO_AD_B1_13)
DCMI_D3: IC8.H12(GPIO_AD_B1_12)
DCMI_D4: IC8.J13(GPIO_AD_B1_11)
DCMI_D5: IC8.L13(GPIO_AD_B1_10)
DCMI_D6: IC8.G14(GPIO_AD_B0_05)
DCMI_D7: IC8.F11(GPIO_AD_B0_04)
DCMI_HSYNC: IC8.L10(GPIO_AD_B0_15)
DCMI_MISO: IC8.E7(GPIO_B0_01)
DCMI_MOSI: IC8.E8(GPIO_B0_02)
DCMI_PCLK: IC8.D13(GPIO_B1_12)
DCMI_PWDN: IC8.C11(GPIO_B1_02)
DCMI_RST: IC8.B11(GPIO_B1_01)
DCMI_SCL: IC8.J11(GPIO_AD_B1_00)
DCMI_SCLK: IC8.D8(GPIO_B0_03)
DCMI_SDA: IC8.K11(GPIO_AD_B1_01)
DCMI_SSEL: IC8.D7(GPIO_B0_00)
DCMI_VSYNC: IC8.D14(GPIO_B1_13)
ETH_INT: IC8.C10(GPIO_B0_12)
ETH_MDC: IC8.A7(GPIO_EMC_40)
ETH_MDIO: IC8.C7(GPIO_EMC_41)
ETH_RST: IC8.D10(GPIO_B0_13)
ETH_RXD0: IC8.E12(GPIO_B1_04)
ETH_RXD1: IC8.D12(GPIO_B1_05)
ETH_RXDV: IC8.C12(GPIO_B1_06)
ETH_RXERR: IC8.C13(GPIO_B1_11)
ETH_TXCLK: IC8.B13(GPIO_B1_10)
ETH_TXD0: IC8.B12(GPIO_B1_07)
ETH_TXD1: IC8.A12(GPIO_B1_08)
ETH_TXEN: IC8.A13(GPIO_B1_09)
INT_I2C_INT: IC8.D11(GPIO_B1_03)
INT_I2C_SCL: IC8.C8(GPIO_B0_04)
INT_I2C_SDA: IC8.B8(GPIO_B0_05)
JTAG_TCK: IC8.F12(GPIO_AD_B0_07)
JTAG_TDI: IC8.F14(GPIO_AD_B0_09)
JTAG_TDO: IC8.G13(GPIO_AD_B0_10)
JTAG_TMS: IC8.E14(GPIO_AD_B0_06)
JTAG_TRSTB: IC8.G10(GPIO_AD_B0_11)
LED_B: IC8.C14(GPIO_B1_14)
LED_G: IC8.A10(GPIO_B0_11)
LED_R: IC8.D9(GPIO_B0_10)
NVCC_PLL: C104.2 C107.1 IC8.P10(NVCC_PLL)
ONOFF: IC8.M6(ONOFF) R70.2
P0_MOSI: IC8.H10(GPIO_AD_B0_01)
P1_MISO: IC8.M11(GPIO_AD_B0_02)
P2_SCLK: IC8.M14(GPIO_AD_B0_00)
P3_NSS: IC8.G11(GPIO_AD_B0_03)
P4_SCL: IC8.K14(GPIO_AD_B0_12)
P5_SDA: IC8.L14(GPIO_AD_B0_13)
P6_ADC: IC8.M12(GPIO_AD_B1_03)
P7_PWM: IC8.A8(GPIO_B0_06)
P8_PWM: IC8.A9(GPIO_B0_07)
P9_PWM: IC8.A11(GPIO_B1_00)
P12_RST_N: C63.1 IC8.M7(POR_B) R33.2
P_FLASH_CE: IC8.L3(GPIO_SD_B1_06)
P_FLASH_IO0: IC8.P3(GPIO_SD_B1_08)
P_FLASH_IO1: IC8.N4(GPIO_SD_B1_09)
P_FLASH_IO2: IC8.P4(GPIO_SD_B1_10)
P_FLASH_IO3: IC8.P5(GPIO_SD_B1_11)
P_FLASH_SCK: IC8.L4(GPIO_SD_B1_07)
PGOOD: IC8.P2(GPIO_SD_B1_04)
PMIC_ON_REQ: IC8.K7(PMIC_ON_REQ)
PMIC_STBY_REQ: IC8.L7(PMIC_STBY_REQ) R69.2
POWER_BUTTON: R70.1 S2.2(COM) S2.3(COM) S2.4(COM)
PWM_FSIN: IC8.M5(GPIO_SD_B1_01)
RTC_XTALI: C80.1 IC8.N9(RTC_XTALI) Y1.2
RTC_XTALO: C79.1 IC8.P9(RTC_XTALO) Y1.1
SD_CD: IC8.L11(GPIO_AD_B1_02)
SD_CLK: IC8.J3(GPIO_SD_B0_01)
SD_CMD: IC8.J4(GPIO_SD_B0_00)
SD_DAT0: IC8.J1(GPIO_SD_B0_02)
SD_DAT1: IC8.K1(GPIO_SD_B0_03)
SD_DAT2: IC8.H2(GPIO_SD_B0_04)
SD_DAT3: IC8.J2(GPIO_SD_B0_05)
SDRAM_A0: IC8.C2(GPIO_EMC_09)
SDRAM_A1: IC8.G1(GPIO_EMC_10)
SDRAM_A2: IC8.G3(GPIO_EMC_11)
SDRAM_A3: IC8.H1(GPIO_EMC_12)
SDRAM_A4: IC8.A6(GPIO_EMC_13)
SDRAM_A5: IC8.B6(GPIO_EMC_14)
SDRAM_A6: IC8.B1(GPIO_EMC_15)
SDRAM_A7: IC8.A5(GPIO_EMC_16)
SDRAM_A8: IC8.A4(GPIO_EMC_17)
SDRAM_A9: IC8.B2(GPIO_EMC_18)
SDRAM_A10: IC8.G2(GPIO_EMC_23)
SDRAM_A11: IC8.B4(GPIO_EMC_19)
SDRAM_A12: IC8.A3(GPIO_EMC_20)
SDRAM_BA0: IC8.C1(GPIO_EMC_21)
SDRAM_BA1: IC8.F1(GPIO_EMC_22)
SDRAM_CAS: IC8.D3(GPIO_EMC_24)
SDRAM_CKE: IC8.A2(GPIO_EMC_27)
SDRAM_CLK: IC8.B3(GPIO_EMC_26)
SDRAM_CS: IC8.E1(GPIO_EMC_29)
SDRAM_DQ0: IC8.E3(GPIO_EMC_00)
SDRAM_DQ1: IC8.F3(GPIO_EMC_01)
SDRAM_DQ2: IC8.F4(GPIO_EMC_02)
SDRAM_DQ3: IC8.G4(GPIO_EMC_03)
SDRAM_DQ4: IC8.F2(GPIO_EMC_04)
SDRAM_DQ5: IC8.G5(GPIO_EMC_05)
SDRAM_DQ6: IC8.H5(GPIO_EMC_06)
SDRAM_DQ7: IC8.H4(GPIO_EMC_07)
SDRAM_DQ8: IC8.C6(GPIO_EMC_30)
SDRAM_DQ9: IC8.C5(GPIO_EMC_31)
SDRAM_DQ10: IC8.D5(GPIO_EMC_32)
SDRAM_DQ11: IC8.C4(GPIO_EMC_33)
SDRAM_DQ12: IC8.D4(GPIO_EMC_34)
SDRAM_DQ13: IC8.E5(GPIO_EMC_35)
SDRAM_DQ14: IC8.C3(GPIO_EMC_36)
SDRAM_DQ15: IC8.E4(GPIO_EMC_37)
SDRAM_DQMH: IC8.D6(GPIO_EMC_38)
SDRAM_DQML: IC8.H3(GPIO_EMC_08)
SDRAM_RAS: IC8.D2(GPIO_EMC_25)
SDRAM_WE: IC8.D1(GPIO_EMC_28)
SWITCH: R67.1 R68.1 S1.2(COM) S1.3(COM) S1.4(COM)
SWITCH_OUT: C25.2 R68.2 R69.1
USB_D_N: IC8.M8(USB_OTG1_DN)
USB_D_P: IC8.L8(USB_OTG1_DP)
VCC_SOC: C34.1 C38.1 C45.1 C46.2 C47.1 C48.1 C49.2 C87.2 C94.2 C97.2 C98.2 C100.2 C103.2 IC8.F6(VDD_SOC_IN_1) IC8.F7(VDD_SOC_IN_2) IC8.F8(VDD_SOC_IN_3) IC8.F9(VDD_SOC_IN_4) IC8.G6(VDD_SOC_IN_5) IC8.G9(VDD_SOC_IN_6) IC8.H6(VDD_SOC_IN_7) IC8.H9(VDD_SOC_IN_8) IC8.J5(DCDC_SENSE) IC8.J9(VDD_SOC_IN_9) L5.1
VDD_HIGH_CAP: C101.2 C102.1 IC8.P8(VDD_HIGH_CAP)
VDD_SNVS_CAP: C70.1 IC8.M10(VDD_SNVS_CAP)
VDD_USB_CAP: C71.1 C72.2 C73.2 IC8.K8(VDD_USB_CAP)
VDDA_ADC_3P3: C59.1 C60.2 C61.2 IC8.N14(VDDA_ADC_3P3) L6.1
WAKEUP: IC8.L6(WAKEUP)
WIFI_CLK: IC8.M13(GPIO_AD_B1_09)
WIFI_CMD: IC8.H13(GPIO_AD_B1_08)
WIFI_D0: IC8.M4(GPIO_SD_B1_03)
WIFI_D1: IC8.M3(GPIO_SD_B1_02)
WIFI_D2: IC8.J12(GPIO_AD_B1_06)
WIFI_D3: IC8.K10(GPIO_AD_B1_07)
WL_H_WAKE: IC8.E11(GPIO_B0_15)
WL_REG_ON: IC8.E10(GPIO_B0_14)
XTALI: C106.1 IC8.P11(XTALI) R40.1 Y2.3(CRYSTAL_2)
XTALO: C105.1 IC8.N11(XTALO) Y2.1(CRYSTAL_1)

Not connected (* = marked no-connect by the designer): IC8 B7(GPIO_EMC_39) N3(GPIO_SD_B1_05) N7(USB_OTG2_DN) N10(GPANAIO) N12(USB_OTG1_CHD_B) N13(CCM_CLK1_P) P6(USB_OTG2_VBUS) P7(USB_OTG2_DP) P13(CCM_CLK1_N)

### Notes on the sheet
- MIMXRT1062
- 3.3V
- SDRAM_DQS
- (near L6) 3.3V
- P_FLASH_DQS
- (near R67) 3.3V

### Library data of the parts
C25 C41 C46 C57 C60 C64 C67 C72 C95 C101 C104 C108 = CAP0402-CAP: as C3 on sheet ideal-diode; DeviceName: 0402-CAP; LibraryName: sfe; DeviceSetName: CAP; Part Number: JMK105BBJ475MV-F
C34 C38 C43 C45 C47 C48 C50 C53-C56 C59 C62 C63 C66 C68-C71 C86-C88 C94 C97-C100 C102 C103 C107 C109 = C-EUC0201: CAPACITOR, European symbol; MPN: GRM033R60J224ME15D; GateName_1: G$1; SymbolName_1: C-EU; POPULARITY: 0; DeviceName: C0201; LibraryName: rcl; DeviceSetName: C-EU; SPICEPREFIX: C; Part Number: GRM033R60J224ME15D
C49 C58 C61 C73 = 22UF-0805-6.3V-20%: as C6 on sheet regulators; DeviceName: -0805-6.3V-20%; LibraryName: SparkFun-Capacitors; DeviceSetName: 22UF; Part Number: CL21A226MQQNNNE
C79 C80 = C-EUC0201: CAPACITOR, European symbol; MPN: GRM0335C1E180JA01D; GateName_1: G$1; SymbolName_1: C-EU; POPULARITY: 0; DeviceName: C0201; LibraryName: rcl; DeviceSetName: C-EU; SPICEPREFIX: C; Part Number: GRM0335C1E180JA01D
C105 C106 = C-EUC0201: CAPACITOR, European symbol; MPN: GRM0335C1E4R7CA01D; GateName_1: G$1; SymbolName_1: C-EU; POPULARITY: 0; DeviceName: C0201; LibraryName: rcl; DeviceSetName: C-EU; SPICEPREFIX: C; Part Number: GRM0335C1E4R7CA01D
IC8 = MIMXRT1052DVL6B: Processors - Application Specialized MIMXRT106FDVL6B/LFBGA196///STANDARD MARKING * TRAY   Source:  Datasheet; MANUFACTURER_NAME: NXP; GateName_1: G$1; HEIGHT: 1.43mm; MANUFACTURER_PART_NUMBER: MIMXRT106FDVL6B; MPN: MIMXRT106FDVL6B; Part Number: MIMXRT106FDVL6B
L5 = MAKK2016T4R7M: INDUCTOR, METAL CORE, SHIELDED, SMD HIGH CURRENT, 4.7uH, 20%, TR Check availability; GateName_1: G$1; MF: Taiyo Yuden; SymbolName_1: MAKK2016T4R7M; LibraryName: MAKK2016T4R7M; DeviceSetName: MAKK2016T4R7M; AVAILABILITY: In Stock; MP: MAKK2016T4R7M; MPN: MAKK2016T4R7M; PACKAGE: 2016 Taiyo Yuden; PRICE: None; PURCHASE-URL: https://pricing.snapeda.com/search/part/MAKK2016T4R7M/?ref=eda; Part Number: MAKK2016T4R7M
L6 = INDUCTOR0402: as L4 on sheet sensor-header; SymbolName_1: INDUCTOR; LibraryName: sfe; DeviceSetName: INDUCTOR; Part Number: MFBM1V1005-101-R
R32 = RESISTOR0402-RES: ResistorBasic schematic elements and footprints for 0603, 1206, and PTH resistors.; MPN: RC0201FR-0730KL; GateName_1: G$1; SymbolName_1: RESISTOR; DeviceName: 0402-RES; LibraryName: sfe; DeviceSetName: RESISTOR; Part Number: RC0201FR-0730KL
R33 = RESISTOR0402-RES: as R58 on sheet jtag; SymbolName_1: RESISTOR; DeviceName: 0402-RES; LibraryName: sfe; DeviceSetName: RESISTOR; MPN: DNP; Part Number: DNP
R40 = RESISTOR0402-RES: ResistorBasic schematic elements and footprints for 0603, 1206, and PTH resistors.; MPN: RC0402FR-072M2L; GateName_1: G$1; SymbolName_1: RESISTOR; DeviceName: 0402-RES; LibraryName: sfe; DeviceSetName: RESISTOR; Part Number: RC0402FR-072M2L
R67 R68 R70 = RESISTOR0402-RES: as R27 on sheet sensor-header; SymbolName_1: RESISTOR; DeviceName: 0402-RES; LibraryName: sfe; DeviceSetName: RESISTOR; Part Number: AC0402FR-1310K
R69 = RESISTOR0402-RES: as R3 on sheet regulators; SymbolName_1: RESISTOR; DeviceName: 0402-RES; LibraryName: sfe; DeviceSetName: RESISTOR; Part Number: CRCW04021M00FKEDC
Y1 = ABS07-32.768KHZ-7-T: Check availability; GateName_1: G$1; MF: Abracon; SymbolName_1: ABS07-32.768KHZ-7-T; LibraryName: ABS07-32.768KHZ-7-T; DeviceSetName: ABS07-32.768KHZ-7-T; AVAILABILITY: In Stock; MP: ABS07-32.768KHZ-7-T; MPN: SC32S-7PF20PPM; PACKAGE: SMD-2 Abracon LLC; PRICE: None; PURCHASE-URL: https://pricing.snapeda.com/search/part/ABS07-32.768KHZ-7-T/?ref=eda; Part Number: SC32S-7PF20PPM
Y2 = XRCGB24M000F3M00R0: Murata 24MHz Crystal +/-30ppm SMD 4-Pin 2 x 1.6 x 0.7mm   Source:  Datasheet; MANUFACTURER_NAME: Murata Electronics; GateName_1: G$1; SymbolName_1: XRCGB24M000F3M00R0; LibraryName: XRCGB24M000F3M00R0; DeviceSetName: XRCGB24M000F3M00R0; HEIGHT: mm; MANUFACTURER_PART_NUMBER: XRCGB24M000F3M00R0; MOUSER_PART_NUMBER: 81-XRCGB24M000F3M0R0; MOUSER_PRICE-STOCK: https://www.mouser.co.uk/ProductDetail/Murata-Electronics/XRCGB24M000F3M00R0?qs=e%252BE4OD6MgMefDn8VvwDdfw%3D%3D; MPN: XRCGB24M000F3M00R0; Part Number: XRCGB24M000F3M00R0
S1 S2 = KMS231GLFS: Part Number: KMS231GLFS; MPN: KMS231GLFS

## Nets that join several sheets
GND: ideal-diode (7 pins), battery-charging (15 pins), regulators (8 pins), sd-card (7 pins), sensor-header (13 pins), jtag (5 pins), wifi-bt (15 pins), mimxrt10xx (81 pins)
RAW: battery-charging (5 pins), regulators (8 pins)
V_BATT: ideal-diode (C4.2 C114.1 IC1.2 IC1.7), battery-charging (C9.2 U2.13)
VBUS: ideal-diode (C3.2 IC1.3), mimxrt10xx (C88.1 C95.2 IC8.N6)
VCC: ideal-diode (D1.4 R14.2), battery-charging (R42.2 R43.2), regulators (C7.1 IC2.6 L2.2 R2.2), sd-card (6 pins), sensor-header (17 pins), jtag (D10.1 J8.1), wifi-bt (17 pins), mimxrt10xx (32 pins)
VDD_SNVS_CPU: regulators (D11.3 Q1.1 Q2.1 Q3.1), mimxrt10xx (C69.1 IC8.M9)
BT_D_WAKE: wifi-bt (U3.39), mimxrt10xx (IC8.L5)
BT_H_WAKE: wifi-bt (R60.2 U3.38), mimxrt10xx (IC8.H14)
BT_REG_ON: jtag (R37.1), wifi-bt (U3.14), mimxrt10xx (IC8.F13)
BT_UART_CTS_N: wifi-bt (U3.5), mimxrt10xx (IC8.L12)
BT_UART_RTS_N: wifi-bt (U3.4), mimxrt10xx (IC8.K12)
BT_UART_RX: wifi-bt (U3.3), mimxrt10xx (IC8.C9)
BT_UART_TX: wifi-bt (U3.2), mimxrt10xx (IC8.B9)
CHG: battery-charging (R1.1 R42.1 U2.9), jtag (R72.2)
DCMI_CLK: sensor-header (J4.12), mimxrt10xx (IC8.B14)
DCMI_D0: sensor-header (J4.31), mimxrt10xx (IC8.J14)
DCMI_D1: sensor-header (J4.29), mimxrt10xx (IC8.G12)
DCMI_D2: sensor-header (J4.35), mimxrt10xx (IC8.H11)
DCMI_D3: sensor-header (J4.28), mimxrt10xx (IC8.H12)
DCMI_D4: sensor-header (J4.26), mimxrt10xx (IC8.J13)
DCMI_D5: sensor-header (J4.33), mimxrt10xx (IC8.L13)
DCMI_D6: sensor-header (J4.24), mimxrt10xx (IC8.G14)
DCMI_D7: sensor-header (J4.22), mimxrt10xx (IC8.F11)
DCMI_HSYNC: sensor-header (J4.18), mimxrt10xx (IC8.L10)
DCMI_MISO: sensor-header (J4.15), mimxrt10xx (IC8.E7)
DCMI_MOSI: sensor-header (J4.17), mimxrt10xx (IC8.E8)
DCMI_PCLK: sensor-header (J4.14), mimxrt10xx (IC8.D13)
DCMI_PWDN: sensor-header (J4.25 R29.1), mimxrt10xx (IC8.C11)
DCMI_RST: sensor-header (J4.21 R27.1), mimxrt10xx (IC8.B11)
DCMI_SCL: sensor-header (J4.32 R30.1), mimxrt10xx (IC8.J11)
DCMI_SCLK: sensor-header (J4.13), mimxrt10xx (IC8.D8)
DCMI_SDA: sensor-header (J4.34 R31.1), mimxrt10xx (IC8.K11)
DCMI_SSEL: sensor-header (J4.11 R24.1), mimxrt10xx (IC8.D7)
DCMI_VSYNC: sensor-header (J4.16), mimxrt10xx (IC8.D14)
JTAG_TCK: jtag (FL5.4), mimxrt10xx (IC8.F12)
JTAG_TDI: jtag (FL5.2 R71.1), mimxrt10xx (IC8.F14)
JTAG_TDO: jtag (FL5.3), mimxrt10xx (IC8.G13)
JTAG_TMS: jtag (FL5.5), mimxrt10xx (IC8.E14)
JTAG_TRSTB: jtag (FL5.6 R72.1), mimxrt10xx (IC8.G10)
LED_CHG: ideal-diode (D1.3), battery-charging (R1.2)
LED_PGOOD: ideal-diode (D1.2), battery-charging (R4.2)
ONOFF: regulators (Q3.2), mimxrt10xx (IC8.M6 R70.2)
P12_RST_N: jtag (FL5.1), mimxrt10xx (C63.1 IC8.M7 R33.2)
PGOOD: battery-charging (R4.1 R43.1 U2.7), mimxrt10xx (IC8.P2)
PMIC_ON_REQ: regulators (Q1.2), mimxrt10xx (IC8.K7)
PWM_FSIN: sensor-header (R28.2 R53.2 R54.2), mimxrt10xx (IC8.M5)
SD_CD: sd-card (FL3.1 J5.CD$1), mimxrt10xx (IC8.L11)
SD_CLK: sd-card (FL3.6), mimxrt10xx (IC8.J3)
SD_CMD: sd-card (FL3.5), mimxrt10xx (IC8.J4)
SD_DAT0: sd-card (FL3.7), mimxrt10xx (IC8.J1)
SD_DAT1: sd-card (FL3.8), mimxrt10xx (IC8.K1)
SD_DAT2: sd-card (FL3.3), mimxrt10xx (IC8.H2)
SD_DAT3: sd-card (FL3.4), mimxrt10xx (IC8.J2)
ST: ideal-diode (IC1.8 R5.1 R14.1), jtag (R71.2)
WAKEUP: regulators (Q2.2), mimxrt10xx (IC8.L6)
WIFI_CLK: wifi-bt (U3.20), mimxrt10xx (IC8.M13)
WIFI_CMD: wifi-bt (R62.1 U3.22), mimxrt10xx (IC8.H13)
WIFI_D0: wifi-bt (R63.1 U3.24), mimxrt10xx (IC8.M4)
WIFI_D1: wifi-bt (R64.1 U3.26), mimxrt10xx (IC8.M3)
WIFI_D2: wifi-bt (R65.1 U3.23), mimxrt10xx (IC8.J12)
WIFI_D3: wifi-bt (R66.1 U3.25), mimxrt10xx (IC8.K10)
WL_H_WAKE: wifi-bt (R61.1 U3.27), mimxrt10xx (IC8.E11)
WL_REG_ON: wifi-bt (U3.28), mimxrt10xx (IC8.E10)